# EAGLE design SparkFun_SOIC8-DIP-Adapter-v10 (EAGLE 5.01)
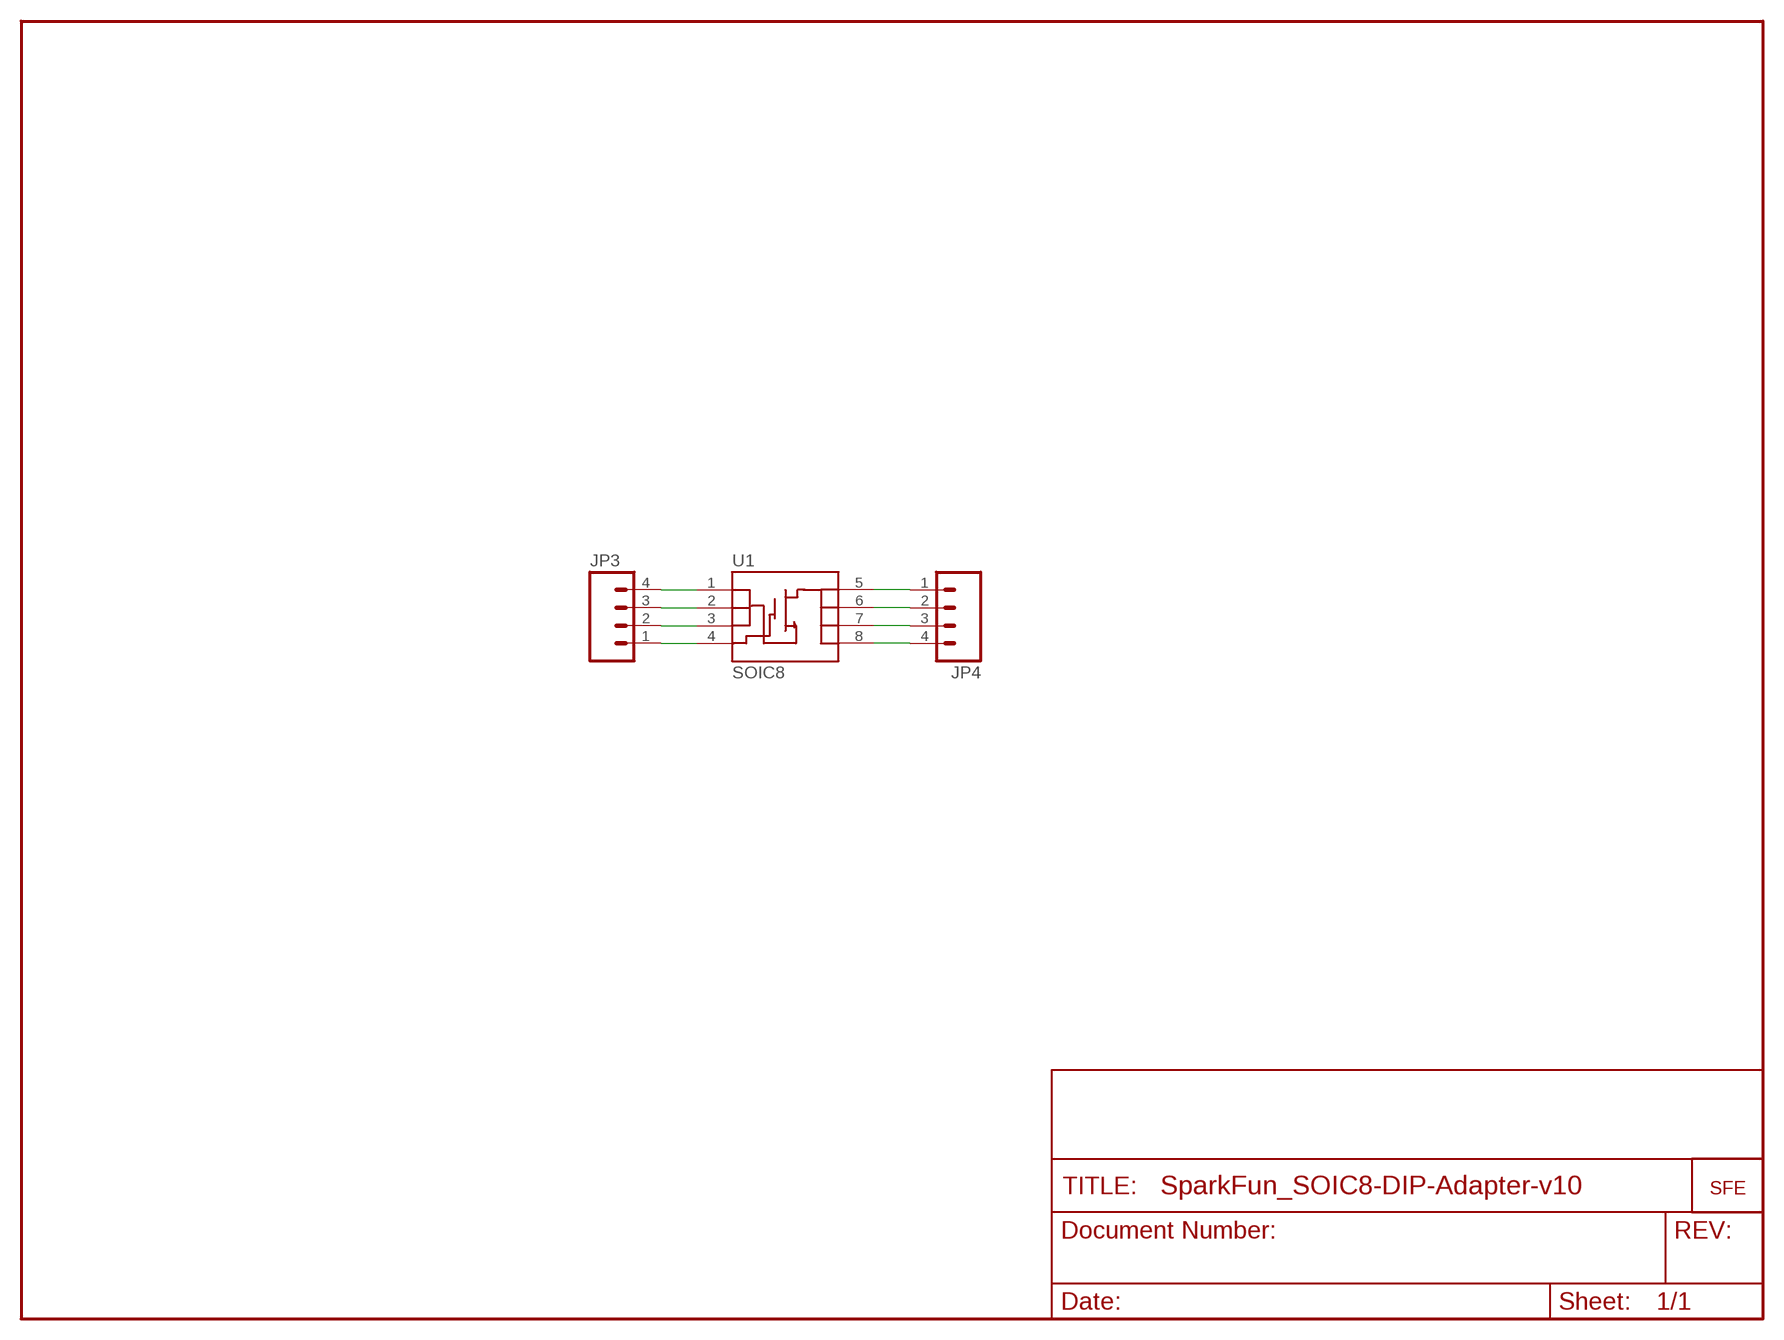
[diagram p0: schematic, sheet 1]

## Parts
JP3  M04PTH  [1X04]
JP4  M04PTH  [1X04]
U1  SOIC8  MOSFET-NCHANNEL-SOIC8  [SO08]
U$1  LOGO-SFESK  [SFE-LOGO-FLAME]

## Nets
N$1: JP4.1 U1.5(D)
N$2: JP4.2 U1.6(D)
N$3: JP4.3 U1.7(D)
N$4: JP4.4 U1.8(D)
N$5: JP3.1 U1.4(G)
N$6: JP3.2 U1.3(S)
N$7: JP3.3 U1.2(S)
N$8: JP3.4 U1.1(S)

## Library data of the parts
JP3 JP4 = SparkFun:M04: Header 4 Standard 4-pin 0.1" header. Use with straight break away headers (SKU : PRT-00116), right angle break away headers (PRT-00553), swiss pins (PRT-00743), machine pins (PRT-00117), and female headers (PRT-00115). Molex polarized connector foot print use with SKU : PRT-08231 with associated crimp pins and housings.
U1 = SparkFun:MOSFET-NCHANNEL-SOIC8: N-Channel MOSFET IRF9410 and NDS8434 are common, SOIC-8 parts.
U$1 = SparkFun:LOGO-SFE: Spark Fun Electronics PCB Logo This is the standard Spark Fun Electronics PCB logo.

## Board
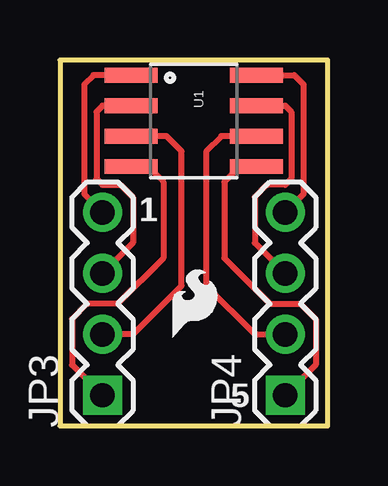
[diagram p1: board, top side]

Size 11.18 x 15.24 mm. Coordinates in mm from the lower left corner, seen from the top.
Outline: 0,0 11.18,0 11.18,15.24 0,15.24 0,0
Copper layers (1*16): Top 0.0356mm / dielectric 1.5011mm / Bottom 0.0356mm
Design rules "default *": minimum track width 8mil, minimum drill 20mil, track to track 8mil, track to pad 8mil, pad to pad 8mil, via to via 8mil, smd to smd 8mil, copper to edge 10mil, drill to drill 8mil, minimum pad ring 12mil, minimum via ring 10mil, stop-mask expansion 4mil, vias tented up to drill 20mil, thermal gap 10mil

### Footprints (pad centres in the part's own frame; a part is rotated, then mirrored left to right if it is on the bottom)
1X04 = drill 1.016 square: 1 0,0 | drill 1.016 round: 2 2.54,0; 3 5.08,0; 4 7.62,0
SO08 = smd 0.61 x 2.21: 1 -1.905,-2.616; 2 -0.635,-2.616; 3 0.635,-2.616; 4 1.905,-2.616; 5 1.905,2.616; 6 0.635,2.616; 7 -0.635,2.616; 8 -1.905,2.616

### Placement (x,y rotation side)
JP3  1.78,1.27 90 top
JP4  9.4,1.27 90 top
U1  5.59,12.7 270 top
U$1  4.7,3.68 0 top

### Tracks (layer width: path | path; a pad name or v marks a point on that pad's centre or on a via)
N$1
  Top 0.254: U1.5 7.49,10.79 6.86,10.16 6.86,6.99 8.76,5.08 10.03,5.08 10.67,4.45 10.67,2.54 JP4.1
N$2
  Top 0.254: U1.6 6.73,12.06 6.1,11.43 6.1,5.84 8.13,3.81 JP4.2
N$3
  Top 0.254: U1.7 9.4,13.34 9.65,13.08 9.65,10.29 9.4,10.03 8.64,10.03 8.13,9.53 8.13,7.62 JP4.3
N$4
  Top 0.254: U1.8 9.78,14.61 10.16,14.22 10.16,9.65 JP4.4
N$5
  Top 0.254: U1.4 3.68,10.79 4.32,10.16 4.32,6.99 2.41,5.08 1.14,5.08 0.51,4.45 0.51,2.54 JP3.1
N$6
  Top 0.254: U1.3 4.45,12.06 5.08,11.43 5.08,5.84 3.05,3.81 JP3.2
N$7
  Top 0.254: U1.2 1.78,13.34 1.52,13.08 1.52,10.29 1.78,10.03 2.54,10.03 3.05,9.53 3.05,7.62 JP3.3
N$8
  Top 0.254: U1.1 1.4,14.61 1.02,14.22 1.02,9.65 JP3.4

### Text on the board
tPlace: 1 | 5